# Altium schematic sheet MB_TOP.SchDoc
size A4; PageSetup: Record=PageOptions|CenterHorizontal=True|CenterVertical=True|PrintScale=0.36|XCorrection=1.00|YCorrection=1.00|PrintKind=0|BorderSize=5000000|LeftOffset=0|BottomOffset=0|Orientation=2|PaperLength=1000|PaperWidth=1000|Scale=100|PaperSource=7|PrintQuality=-4|MediaType=1|DitherType=10|PaperKind=A4|PrintScaleMode=1
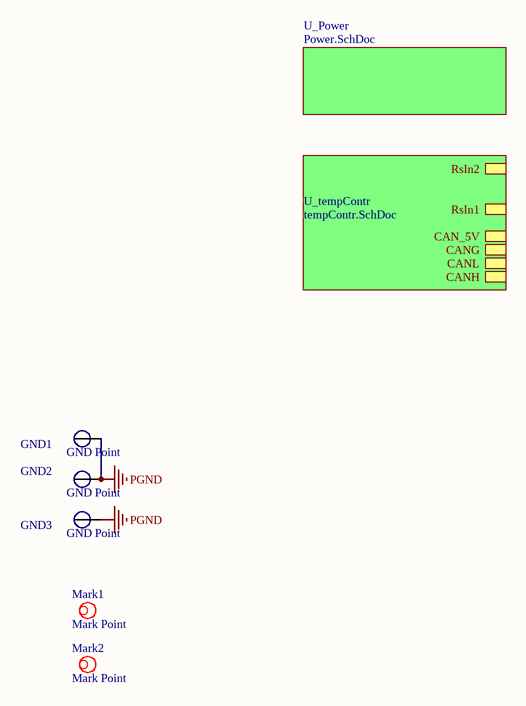
[diagram p0: MB_TOP.SchDoc]

## Parts
GND1  GND Point  [Gnd_Point]
GND2  GND Point  [Gnd_Point]
GND3  GND Point  [Gnd_Point]
Mark1  Mark Point  [MARK 3mm]
Mark2  Mark Point  [MARK 3mm]

## Sub-sheets
U_Power = Power.SchDoc: no entries
U_tempContr = tempContr.SchDoc: CANH, CANL, CANG, CAN_5V, RsIn1, RsIn2

## Nets
PGND: GND1.1(GND) GND2.1(GND) GND3.1(GND)

## Library data of the parts
GND1-GND3 = GND_Point
Mark1 Mark2 = MARK